# EAGLE design PCBWayPrototype (EAGLE 9.6.2)
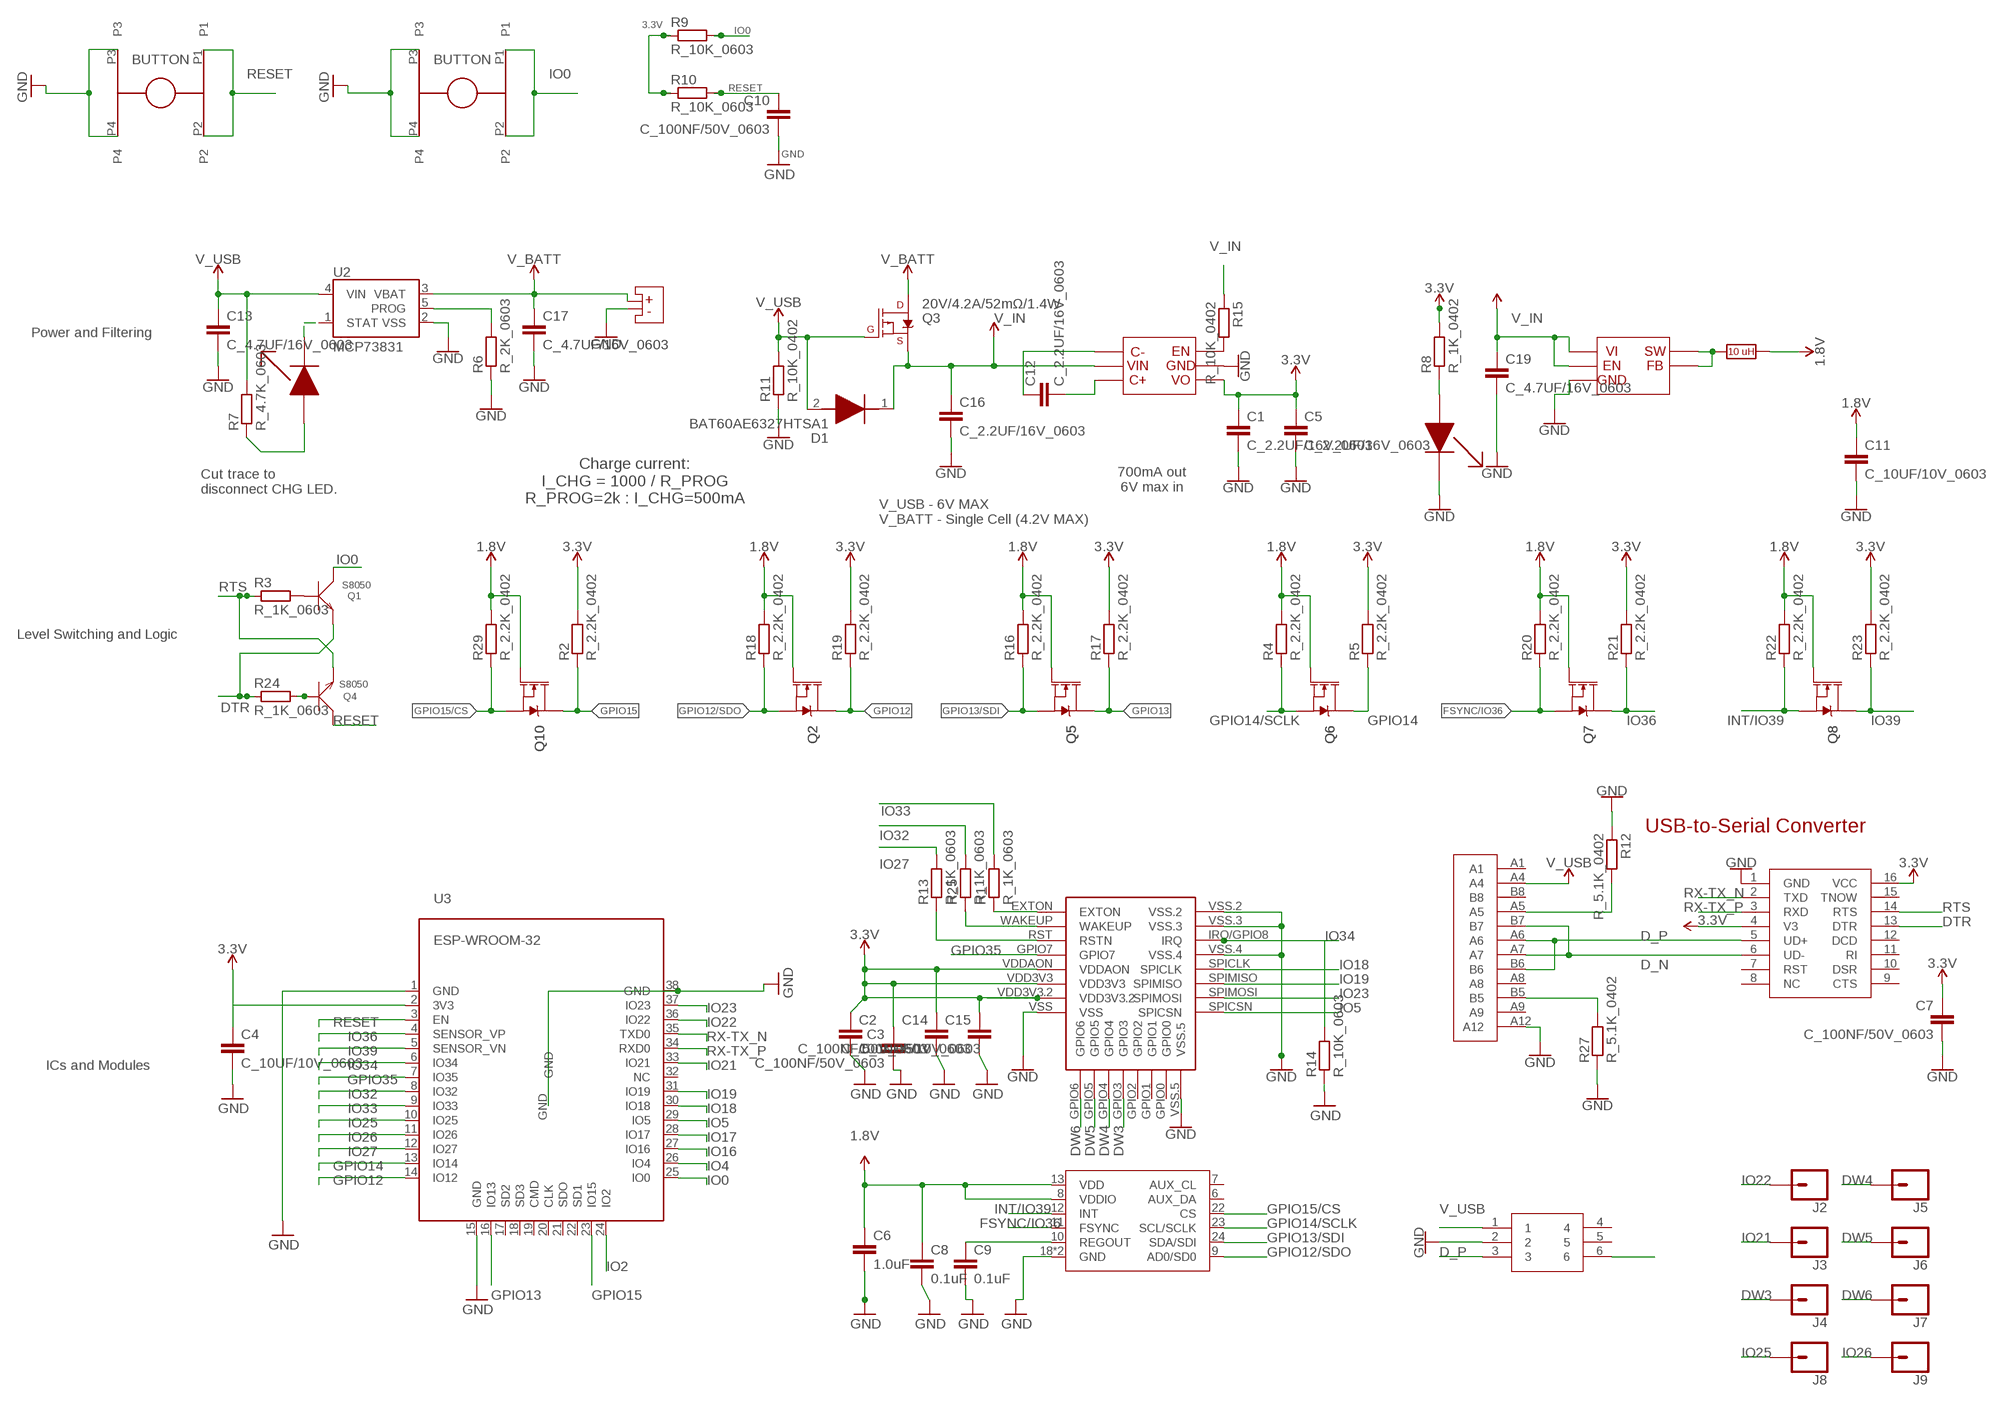
[diagram p0: schematic, sheet 1]

## Parts
C1  C_2.2UF/16V_0603  [C0603]
C2  C_10UF/10V_0603  [C0603]
C3  C_100NF/50V_0603  [C0603]
C4  C_10UF/10V_0603  [C0603]
C5  C_2.2UF/16V_0603  [C0603]
C6  1.0uF  1.0UF-0603-16V-10%-X7R  [0603]
C7  C_100NF/50V_0603  [C0603]
C8  0.1uF  0.1UF-0603-25V-5%  [0603]
C9  0.1uF  0.1UF-0603-25V-5%  [0603]
C10  C_100NF/50V_0603  [C0603]
C11  C_10UF/10V_0603  [C0603]
C12  C_2.2UF/16V_0603  [C0603]
C13  C_4.7UF/16V_0603  [C0603]
C14  C_100NF/50V_0603  [C0603]
C15  C_100NF/50V_0603  [C0603]
C16  C_2.2UF/16V_0603  [C0603]
C17  C_4.7UF/16V_0603  [C0603]
C19  C_4.7UF/16V_0603  [C0603]
D1  BAT60AE6327HTSA1  [SOD2513X110N]
J2  CONN_01PTH_2MM  [1X01_2MM]
J3  CONN_01PTH_2MM  [1X01_2MM]
J4  CONN_01PTH_2MM  [1X01_2MM]
J5  CONN_01PTH_2MM  [1X01_2MM]
J6  CONN_01PTH_2MM  [1X01_2MM]
J7  CONN_01PTH_2MM  [1X01_2MM]
J8  CONN_01PTH_2MM  [1X01_2MM]
J9  CONN_01PTH_2MM  [1X01_2MM]
Q1  S8050  TRANSISTOR-NPN-SOT23  [SOT23]
Q2  20V/0.2A/8MHz/1.2Ω/1Vth  MOSFET-NCH-RE1C002UN  [SOT-416FL]
Q3  20V/4.2A/52mΩ/1.4W  MOSFET_PCH-DMG2305UX-7  [SOT23-3@1]
Q4  S8050  TRANSISTOR-NPN-SOT23  [SOT23]
Q5  20V/0.2A/8MHz/1.2Ω/1Vth  MOSFET-NCH-RE1C002UN  [SOT-416FL]
Q6  20V/0.2A/8MHz/1.2Ω/1Vth  MOSFET-NCH-RE1C002UN  [SOT-416FL]
Q7  20V/0.2A/8MHz/1.2Ω/1Vth  MOSFET-NCH-RE1C002UN  [SOT-416FL]
Q8  20V/0.2A/8MHz/1.2Ω/1Vth  MOSFET-NCH-RE1C002UN  [SOT-416FL]
Q10  20V/0.2A/8MHz/1.2Ω/1Vth  MOSFET-NCH-RE1C002UN  [SOT-416FL]
R1  R_1K_0603  [R0603]
R2  R_2.2K_0402  [R0402]
R3  R_1K_0603  [R0603]
R4  R_2.2K_0402  [R0402]
R5  R_2.2K_0402  [R0402]
R6  R_2K_0603  [R0603]
R7  R_4.7K_0603  [R0603]
R8  R_1K_0402  [R0402]
R9  R_10K_0603  [R0603]
R10  R_10K_0603  [R0603]
R11  R_10K_0402  [R0402]
R12  R_5.1K_0402  [R0402]
R13  R_1K_0603  [R0603]
R14  R_10K_0603  [R0603]
R15  R_10K_0402  [R0402]
R16  R_2.2K_0402  [R0402]
R17  R_2.2K_0402  [R0402]
R18  R_2.2K_0402  [R0402]
R19  R_2.2K_0402  [R0402]
R20  R_2.2K_0402  [R0402]
R21  R_2.2K_0402  [R0402]
R22  R_2.2K_0402  [R0402]
R23  R_2.2K_0402  [R0402]
R24  R_1K_0603  [R0603]
R25  R_1K_0603  [R0603]
R27  R_5.1K_0402  [R0402]
R29  R_2.2K_0402  [R0402]
U2  MCP73831  [SOT23-5]
U3  ESP-WROOM-32  [ESP-WROOM-32]
U5  DWM1000  [DWM1000]
U$1  K2-6639SP-C4SC-04_C83206  [K2-6639SP-C4SC-04]
U$2  MLF2012  [MLF2012]
U$3  K2-6639SP-C4SC-04_C83206  [K2-6639SP-C4SC-04]
U$4  TPS62202DBVR  [TPS62202DBVR]
U$5  HE9008M6R  [HE9008M6R]
U$6  19-217/GHC-YR1S2/3T  [19-217/GHC-YR1S2/3T]
U$7  TPSMF05CT1G  [TPSMF05CT1G]
U$8  SM02B_PASS_TB_LF  [SM02B_PASS_TB_LF]
U$9  19-217/GHC-YR1S2/3T  [19-217/GHC-YR1S2/3T]
U$10  USBC19  [USBC19]
U$11  CH340B  [SOP-16]
U$12  ICM20948  [ICM20948]

## Nets
1.8V: C6.1 C8.1 C11.1 Q2.1(G) Q5.1(G) Q6.1(G) Q7.1(G) Q8.1(G) Q10.1(G) R4.2 R16.2 R18.2 R20.2 R22.2 R29.2 U$2.2 U$12.8(VDDIO) U$12.13(VDD)
3.3V: C1.1 C2.1 C3.1 C4.1 C5.1 C7.1 C14.1 C15.1 R2.2 R5.2 R8.2 R9.1 R10.1 R17.2 R19.2 R21.2 R23.2 U3.2(3V3) U5.VDD3V3 U5.VDD3V3.2 U5.VDDAON U$5.VOUT(VO) U$11.4(V3) U$11.16(VCC)
CHG_LED: R7.1 U$6.2
D_N [diff-pair-D]: U$7.6 U$10.A7 U$10.B7 U$11.6(UD-)
D_P [diff-pair-D]: U$7.3 U$10.A6 U$10.B6 U$11.5(UD+)
DTR: Q1.2(E) R24.1 U$11.13(DTR)
DW3: J4.1 U5.GPIO3
DW4: J5.1 U5.GPIO4
DW5: J6.1 U5.GPIO5
DW6: J7.1 U5.GPIO6
FSYNC/IO36: Q7.2(S) R20.1 U$12.11(FSYNC)
GND: C1.2 C2.2 C3.2 C4.2 C5.2 C6.2 C7.2 C8.2 C9.2 C10.2 C11.2 C13.2 C14.2 C15.2 C16.2 C17.2 C19.2 R6.1 R11.1 R12.1 R14.1 R27.1 U2.2(VSS) U3.1(GND) U3.15(GND) U3.38(GND) U3.GND U5.VSS U5.VSS.2 U5.VSS.3 U5.VSS.4 U5.VSS.5 U$1.P3 U$1.P4 U$3.P3 U$3.P4 U$4.2(GND) U$5.GND U$7.2 U$8.3(-) U$9.1 U$10.A12 U$11.1(GND) U$12.18(GND) U$12.20(GND)
GPIO12: Q2.3(D) R19.1 U3.14(IO12)
GPIO12/SDO: Q2.2(S) R18.1 U$12.9(AD0/SD0)
GPIO13: Q5.3(D) R17.1 U3.16(IO13)
GPIO13/SDI: Q5.2(S) R16.1 U$12.24(SDA/SDI)
GPIO14: Q6.3(D) R5.1 U3.13(IO14)
GPIO14/SCLK: Q6.2(S) R4.1 U$12.23(SCL/SCLK)
GPIO15: Q10.3(D) R2.1 U3.23(IO15)
GPIO15/CS: Q10.2(S) R29.1 U$12.22(CS)
GPIO35: U3.7(IO35) U5.GPIO7
INT/IO39: Q8.2(S) R22.1 U$12.12(INT)
IO0: Q1.3(C) R9.2 U3.25(IO0) U$3.P1 U$3.P2
IO2: U3.24(IO2)
IO4: U3.26(IO4)
IO5: U3.29(IO5) U5.SPICSN
IO16: U3.27(IO16)
IO17: U3.28(IO17)
IO18: U3.30(IO18) U5.SPICLK
IO19: U3.31(IO19) U5.SPIMISO
IO21: J3.1 U3.33(IO21)
IO22: J2.1 U3.36(IO22)
IO23: U3.37(IO23) U5.SPIMOSI
IO25: J8.1 U3.10(IO25)
IO26: J9.1 U3.11(IO26)
IO27: R13.2 U3.12(IO27)
IO32: R25.2 U3.8(IO32)
IO33: R1.2 U3.9(IO33)
IO34: R14.2 U3.6(IO34) U5.IRQ/GPIO8(IRQ)
IO36: Q7.3(D) R21.1 U3.4(SENSOR_VP)
IO39: Q8.3(D) R23.1 U3.5(SENSOR_VN)
N$1: Q4.1(B) R24.2
N$2: Q1.1(B) R3.2
N$3: R6.2 U2.5(PROG)
N$4: R8.1 U$9.2
N$7: U2.1(STAT) U$6.1
N$8: U$2.1 U$4.4(FB) U$4.5(SW)
N$9: R15.2 U$5.EN
N$10: R1.1 U5.EXTON
N$11: R25.1 U5.WAKEUP
N$12: R13.1 U5.RST(RSTN)
N$13: C9.1 U$12.10(REGOUT)
N$14: C12.1 U$5.C-
N$15: C12.2 U$5.C+
N$16: R27.2 U$10.B5
N$17: R12.2 U$10.A5
RESET: C10.1 Q4.3(C) R10.2 U3.3(EN) U$1.P1 U$1.P2
RTS: Q4.2(E) R3.1 U$11.14(RTS)
RX-TX_N [diff-pair-RT]: U3.35(TXD0) U$11.2(TXD)
RX-TX_P [diff-pair-RT]: U3.34(RXD0) U$11.3(RXD)
V_BATT: C17.1 Q3.3(D) U2.3(VBAT) U$8.4(+)
V_IN: C16.1 C19.1 D1.1(K) Q3.2(S) R15.1 U$4.1(VI) U$4.3(EN) U$5.VIN ; supply symbol labelled VIN
V_USB: C13.1 D1.2(A) Q3.1(G) R7.2 R11.2 U2.4(VIN) U$7.1 U$10.A4
Unconnected: U3.17(SD2) U3.18(SD3) U3.19(CMD) U3.20(CLK) U3.21(SDO) U3.22(SD1) U3.32(NC) U5.GPIO0 U5.GPIO1 U5.GPIO2 U$7.4 U$7.5 U$10.A1 U$10.A8 U$10.A9 U$10.B8 U$11.7(RST) U$11.8(NC) U$11.9(CTS) U$11.10(DSR) U$11.11(RI) U$11.12(DCD) U$11.15(TNOW) U$12.6(AUX_DA) U$12.7(AUX_CL)

## Notes on the sheet
- Power and Filtering
- 700mA out
  6V max in
- Charge current:
  I_CHG = 1000 / R_PROG
  R_PROG=2k : I_CHG=500mA
- Cut trace to 
  disconnect CHG LED.
- V_USB - 6V MAX
  V_BATT - Single Cell (4.2V MAX)
- Level Switching and Logic
- USB-to-Serial Converter
- ICs and Modules

## Library data of the parts
C1 C5 C12 C16 = JLC PCB Basic Parts_loc:C_: Capacitor General purpose SMD Capacitor; LCSC_DATASHEET: https://datasheet.lcsc.com/lcsc/1810271109_Samsung-Electro-Mechanics-CL10A225KO8NNNC_C23630.pdf; LCSC_PART: C23630; LCSC_ROTATION_CCW: 0; LCSC_STOCK: 1324345; PROPERTIES: 16V 2.2uF X5R ±10% 0603 ROHS
C2 C4 C11 = JLC PCB Basic Parts_loc:C_: Capacitor General purpose SMD Capacitor; LCSC_DATASHEET: https://datasheet.lcsc.com/lcsc/1810191219_Samsung-Electro-Mechanics-CL10A106KP8NNNC_C19702.pdf; LCSC_PART: C19702; LCSC_ROTATION_CCW: 0; LCSC_STOCK: 2089400; PROPERTIES: 10V 10uF X5R ±10% 0603 ROHS
C3 C7 C10 C14 C15 = JLC PCB Basic Parts_loc:C_: Capacitor General purpose SMD Capacitor; LCSC_DATASHEET: https://datasheet.lcsc.com/lcsc/1809301912_YAGEO-CC0603KRX7R9BB104_C14663.pdf; LCSC_PART: C14663; LCSC_ROTATION_CCW: 0; LCSC_STOCK: 7111530; PROPERTIES: 50V 100nF X7R ±10% 0603 ROHS
C6 = SparkFun-Capacitors:1.0UF: 1µF ceramic capacitors A capacitor is a passive two-terminal electrical component used to store electrical energy temporarily in an electric field.; PROD_ID: CAP-13930
C8 C9 = SparkFun-Capacitors:0.1UF: 0.1µF ceramic capacitors A capacitor is a passive two-terminal electrical component used to store electrical energy temporarily in an electric field.; PROD_ID: CAP-08604
C13 C17 C19 = JLC PCB Basic Parts_loc:C_: Capacitor General purpose SMD Capacitor; LCSC_DATASHEET: https://datasheet.lcsc.com/lcsc/1810261514_Samsung-Electro-Mechanics-CL10A475KO8NNNC_C19666.pdf; LCSC_PART: C19666; LCSC_ROTATION_CCW: 0; LCSC_STOCK: 2027167; PROPERTIES: 16V 4.7uF X5R ±10% 0603 ROHS
D1 = BAT60AE6327HTSA1:BAT60AE6327HTSA1: INFINEON - BAT60AE6327HTSA1 - RECTIFIER, SCHOTTKY, 3A, 10V, SOD-323 Source: Datasheet <https://www.infineon.com/dgdl/Infineon-BAT60ASERIES-DS-v01_01-en.pdf?fileId=db3a304313d846880113def70c9304a9>; DESCRIPTION: INFINEON - BAT60AE6327HTSA1 - RECTIFIER, SCHOTTKY, 3A, 10V, SOD-323; HEIGHT: 1.1mm; MANUFACTURER_NAME: Infineon; MANUFACTURER_PART_NUMBER: BAT60AE6327HTSA1; MOUSER_PART_NUMBER: 726-BAT60AE6327HTSA1; MOUSER_PRICE-STOCK: https://www.mouser.co.uk/ProductDetail/Infineon-Technologies/BAT60AE6327HTSA1?qs=OwbwYO03UsIW3Y2lCXbs8Q%3D%3D
J2-J9 = SparkFun-Connectors:CONN_01: Single connection point. Often used as Generic Header-pin footprint for 0.1 inch spaced/style header connections On any of the 0.1 inch spaced packages, you can populate with these: Break Away Headers - Straight <https://www.sparkfun.com/products/116> (PRT-00116) Break Away Male Headers - Right Angle <https://www.sparkfun.com/products/553> (PRT-00553) Female Headers <https://www.sparkfun.com/products/115> (PRT-00115) Break Away Headers - Machine Pin <https://www.sparkfun.com/products/117> (PRT-00117) Break Away Female Headers - Swiss Machine Pin <https://www.sparkfun.com/products/743> (PRT-00743) This device is also useful as a general connection point to wire up your design to another part of your project. Our various solder wires solder well into these plated through hole pads. Hook-Up Wire - Assortment (Stranded, 22 AWG) <https://www.sparkfun.com/products/11375> (PRT-11375) Hook-Up Wire - Assortment (Solid Core, 22 AWG) <https://www.sparkfun.com/products/11367> (PRT-11367) View the entire wire category on our website here <https://www.sparkfun.com/categories/141> Special notes: SMTSO-256-ET is a "flush mount" nut for a 4-40 screw. We mostly use this on specialty testbeds; it is a nice way to connect hardware to your PCB at an adjustable hieght. Also note, the SNAP packages are for using a snappable style connector. We sell a baggie of snaps and they are also used on two LilyPad designs: Snap Assortment - 30 pack (male and female) <https://www.sparkfun.com/products/11347> (DEV-11347) LilyPad Arduino SimpleSnap <https://www.sparkfun.com/products/10941> (DEV-10941) LilyPad SimpleSnap Protoboard <https://www.sparkfun.com/products/10940> (DEV-10940)
Q1 Q4 = Discrete:TRANSISTOR-NPN*: NPN audion
Q2 Q5-Q8 Q10 = SparkFun-DiscreteSemi:MOSFET-NCH: N-channel MOSFETs Voltage controlled devices that allow control of high current outputs. SparkFun Products: SparkFun OpenScale <https://www.sparkfun.com/products/13261> SparkFun Digital Sandbox <https://www.sparkfun.com/products/12651> SparkFun Monster Moto Shield <https://www.sparkfun.com/products/10182> SparkFun MOSFET Power Controller <https://www.sparkfun.com/products/11214>; PROD_ID: TRANS_14399
Q3 = SparkFun-DiscreteSemi:MOSFET_PCH: P-channel MOSFETs Voltage controlled devices that allow control of high current outputs. SparkFun Products: SparkFun ESP32 Thing <https://www.sparkfun.com/products/13907> SparkFun ESP8266 Thing <https://www.sparkfun.com/products/13231> SparkFun Pi Servo HAT V2 <https://www.sparkfun.com/products/15316> DMG2305UX-7 (20V/4.2A/SOT23-3); PROD_ID: TRANS-14388
R1 R3 R13 R24 R25 = JLC PCB Basic Parts_loc:R_: Resistor General purpose SMD Resistor; LCSC_DATASHEET: https://datasheet.lcsc.com/lcsc/2110252030_UNI-ROYAL-Uniroyal-Elec-0603WAF1001T5E_C21190.pdf; LCSC_PART: C21190; LCSC_ROTATION_CCW: 0; LCSC_STOCK: 5175299; PROPERTIES: ±1% 1/10W Thick Film Resistors 75V ±100ppm -55°C~+155°C 1kOhm 0603 ROHS
R2 R4 R5 R16-R23 R29 = JLC PCB Basic Parts_loc:R_: Resistor General purpose SMD Resistor; LCSC_DATASHEET: https://datasheet.lcsc.com/lcsc/2110260030_UNI-ROYAL-Uniroyal-Elec-0402WGF2201TCE_C25879.pdf; LCSC_PART: C25879; LCSC_ROTATION_CCW: 0; LCSC_STOCK: 387501; PROPERTIES: ±1% 1/16W Thick Film Resistors 50V ±100ppm -55°C~+155°C 2.2kOhm 0402 ROHS
R6 = JLC PCB Basic Parts_loc:R_: Resistor General purpose SMD Resistor; LCSC_DATASHEET: https://datasheet.lcsc.com/lcsc/2110252130_UNI-ROYAL-Uniroyal-Elec-0603WAF2001T5E_C22975.pdf; LCSC_PART: C22975; LCSC_ROTATION_CCW: 0; LCSC_STOCK: 3372290; PROPERTIES: ±1% 1/10W Thick Film Resistors 75V ±100ppm -55°C~+155°C 2kOhm 0603 ROHS
R7 = JLC PCB Basic Parts_loc:R_: Resistor General purpose SMD Resistor; LCSC_DATASHEET: https://datasheet.lcsc.com/lcsc/2110252130_UNI-ROYAL-Uniroyal-Elec-0603WAF4701T5E_C23162.pdf; LCSC_PART: C23162; LCSC_ROTATION_CCW: 0; LCSC_STOCK: 3103173; PROPERTIES: ±1% 1/10W Thick Film Resistors 75V ±100ppm -55°C~+155°C 4.7kOhm 0603 ROHS
R8 = JLC PCB Basic Parts_loc:R_: Resistor General purpose SMD Resistor; LCSC_DATASHEET: https://datasheet.lcsc.com/lcsc/2110251730_UNI-ROYAL-Uniroyal-Elec-0402WGF1001TCE_C11702.pdf; LCSC_PART: C11702; LCSC_ROTATION_CCW: 0; LCSC_STOCK: 3758383; PROPERTIES: ±1% 1/16W Thick Film Resistors 50V ±100ppm -55°C~+155°C 1kOhm 0402 ROHS
R9 R10 R14 = JLC PCB Basic Parts_loc:R_: Resistor General purpose SMD Resistor; LCSC_DATASHEET: https://datasheet.lcsc.com/lcsc/2110260030_UNI-ROYAL-Uniroyal-Elec-0603WAF1002T5E_C25804.pdf; LCSC_PART: C25804; LCSC_ROTATION_CCW: 0; LCSC_STOCK: 7979018; PROPERTIES: ±1% 1/10W Thick Film Resistors 75V ±100ppm -55°C~+155°C 10kOhm 0603 ROHS
R11 R15 = JLC PCB Basic Parts_loc:R_: Resistor General purpose SMD Resistor; LCSC_DATASHEET: https://datasheet.lcsc.com/lcsc/2110260030_UNI-ROYAL-Uniroyal-Elec-0402WGF1002TCE_C25744.pdf; LCSC_PART: C25744; LCSC_ROTATION_CCW: 0; LCSC_STOCK: 11564817; PROPERTIES: ±1% 1/16W Thick Film Resistors 50V ±100ppm -55°C~+155°C 10kOhm 0402 ROHS
R12 R27 = JLC PCB Basic Parts_loc:R_: Resistor General purpose SMD Resistor; LCSC_DATASHEET: https://datasheet.lcsc.com/lcsc/2110260030_UNI-ROYAL-Uniroyal-Elec-0402WGF5101TCE_C25905.pdf; LCSC_PART: C25905; LCSC_ROTATION_CCW: 0; LCSC_STOCK: 1228443; PROPERTIES: ±1% 1/16W Thick Film Resistors 50V ±100ppm -55°C~+155°C 5.1kOhm 0402 ROHS
U2 = SparkFun-IC-Power:MCP73831: MCP73831T Li-Ion, Li-Pol Controller Miniature single cell, fully integrated Li-Ion, Li-polymer charge management controller Datasheet <http://ww1.microchip.com/downloads/en/DeviceDoc/20001984g.pdf> SparkFun Products: SparkFun ESP32 Thing <https://www.sparkfun.com/products/13907> SparkFun 9DoF Razor IMU M0 <https://www.sparkfun.com/products/14001>; PROD_ID: IC-09995
U3 = ESP32:ESP-WROOM-32
U5 = DWM1000:DWM1000
U$1 U$3 = customlib:K2-6639SP-C4SC-04_C83206: K2-6639SP-C4SC-04_C83206 button, https://datasheet.lcsc.com/lcsc/2108131530_Korean-Hroparts-Elec-K2-6639SP-C4SC-04_C83206.pdf
U$2 = customlib:MLF2012: MLF2012 0805 10uH Inductor
U$4 = customlib:TPS62202DBVR
U$5 = customlib:HE9008M6R
U$6 U$9 = customlib:19-217/GHC-YR1S2/3T
U$7 = customlib:TPSMF05CT1G
U$8 = customlib:SM02B_PASS_TB_LF
U$10 = customlib:USBC19
U$11 = customlib:CH340B
U$12 = customlib:ICM20948

## Net classes
0 default: width 0.127 mm, drill 0.305 mm
1 power: width 0.305 mm, drill 0.305 mm

## Board
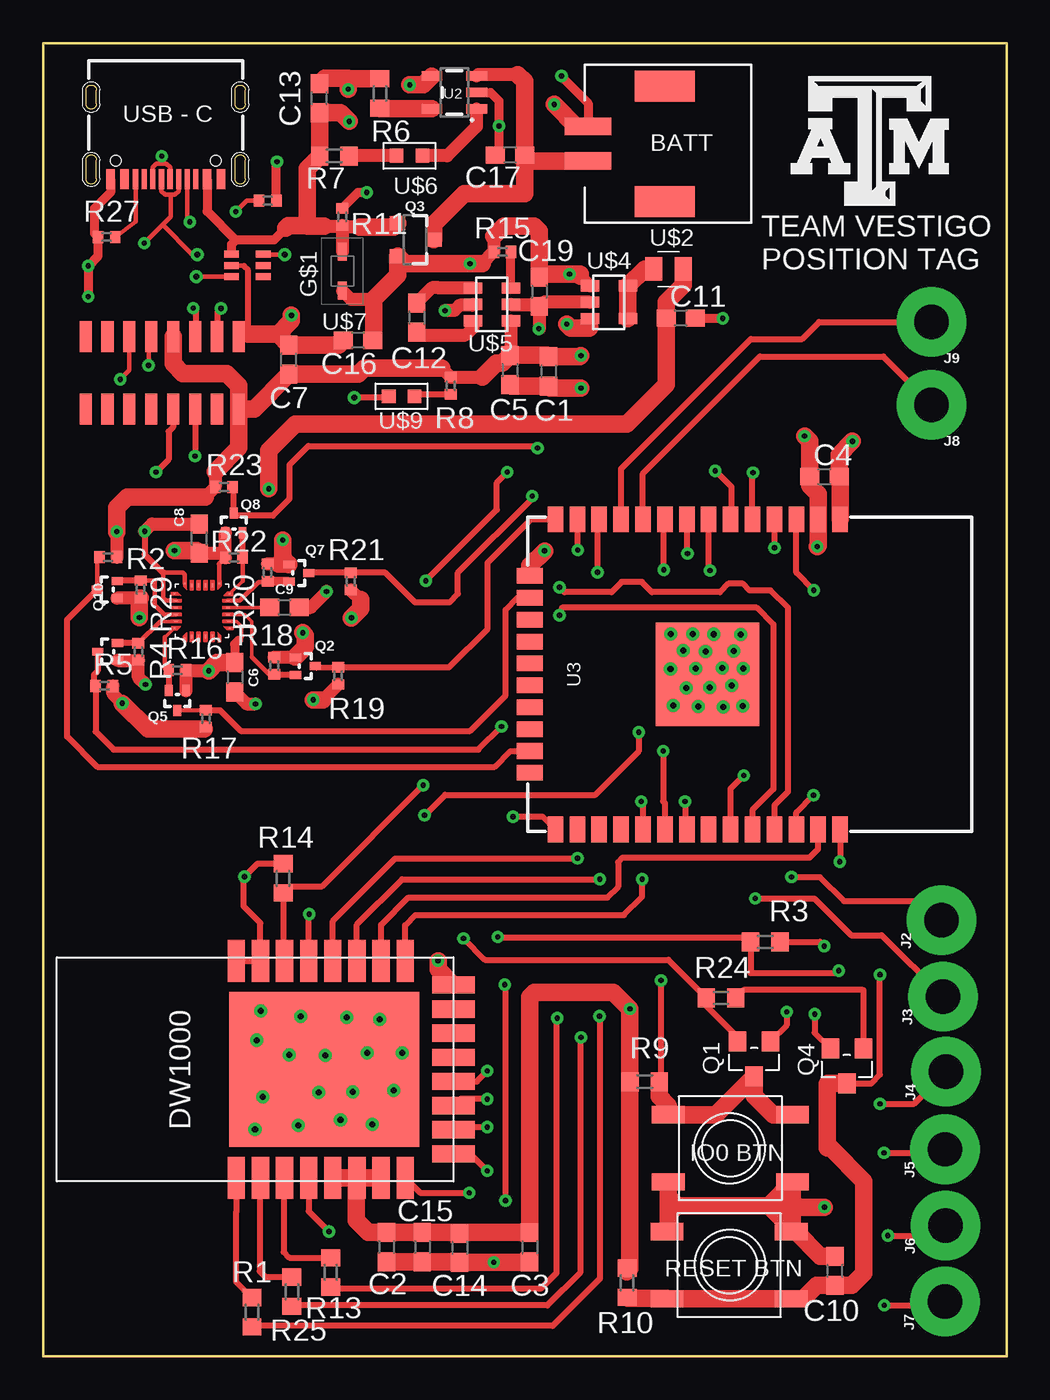
[diagram p1: board, top side]
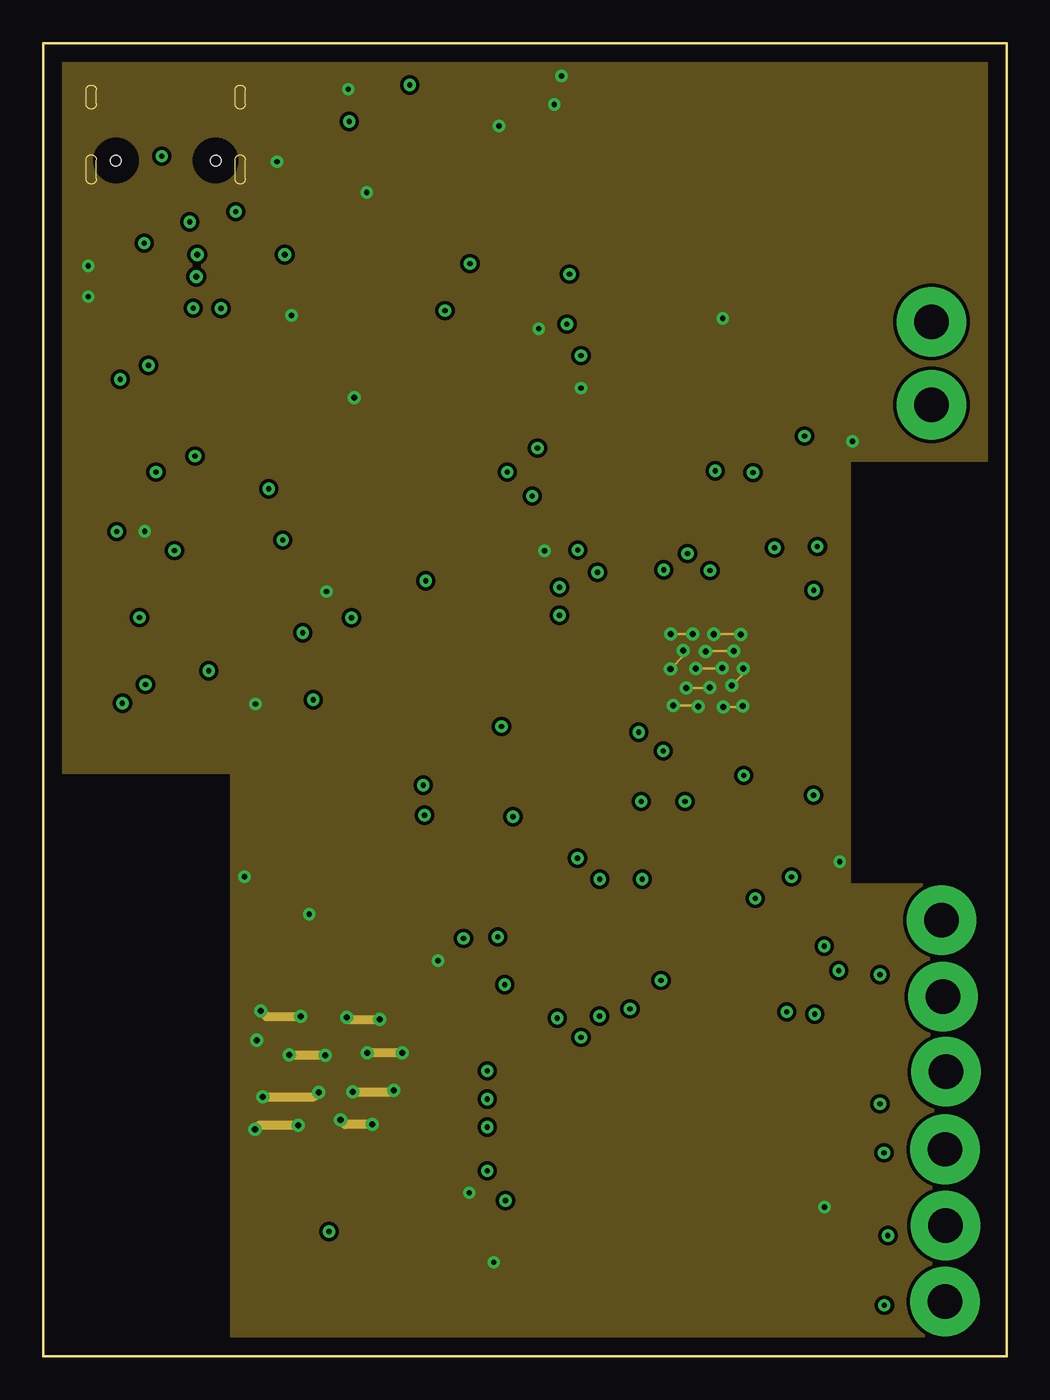
[diagram p2: board, inner layer GND1]
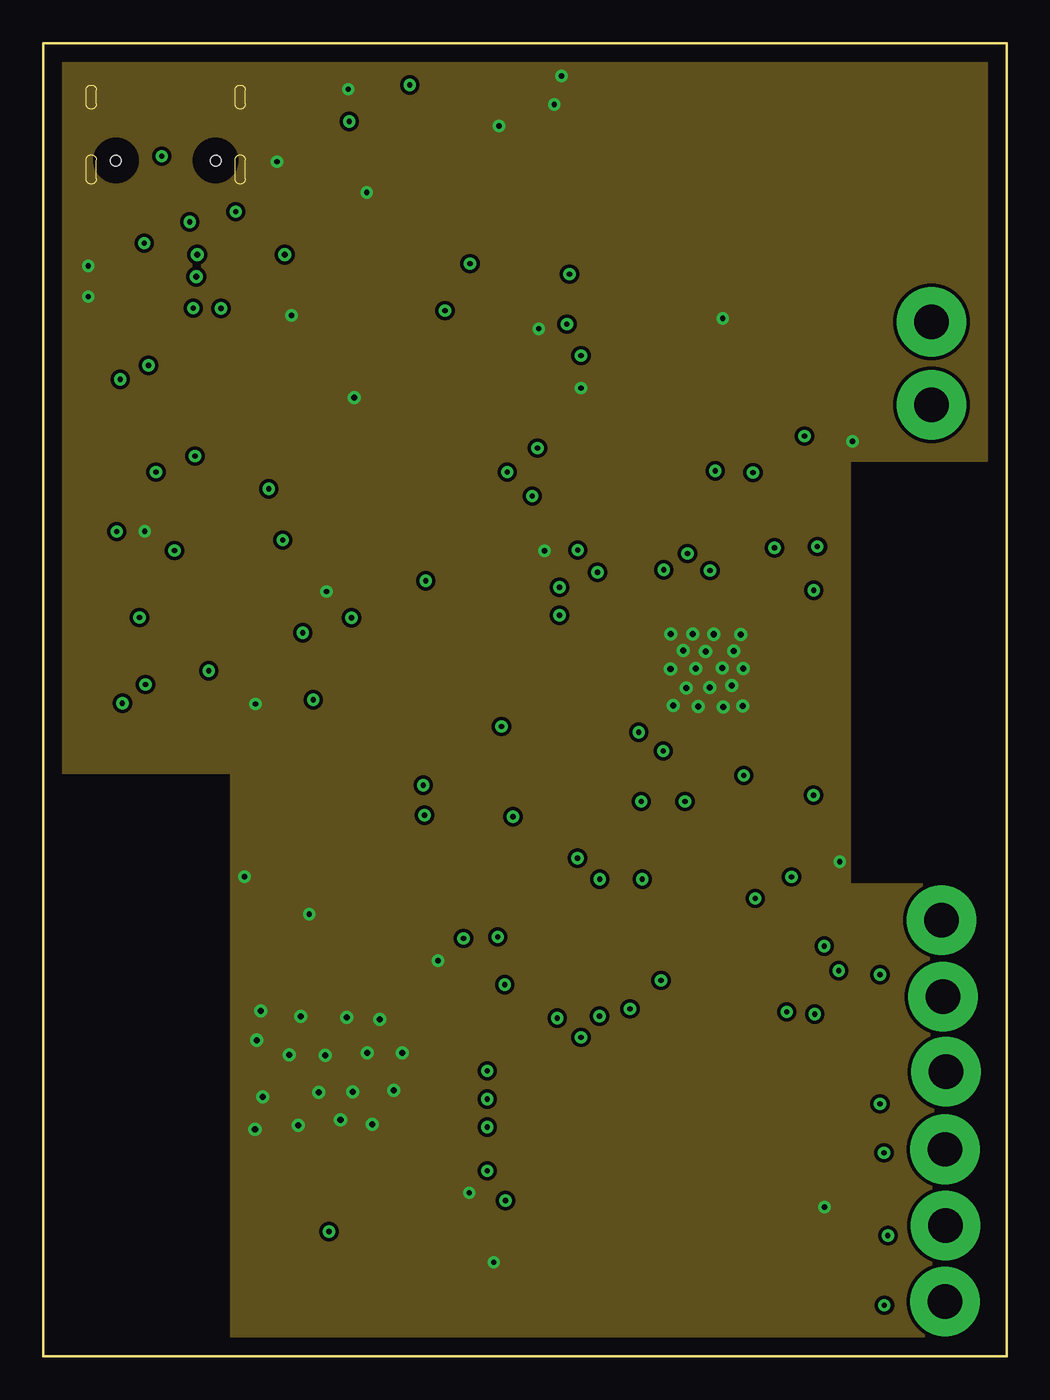
[diagram p3: board, inner layer GND2]
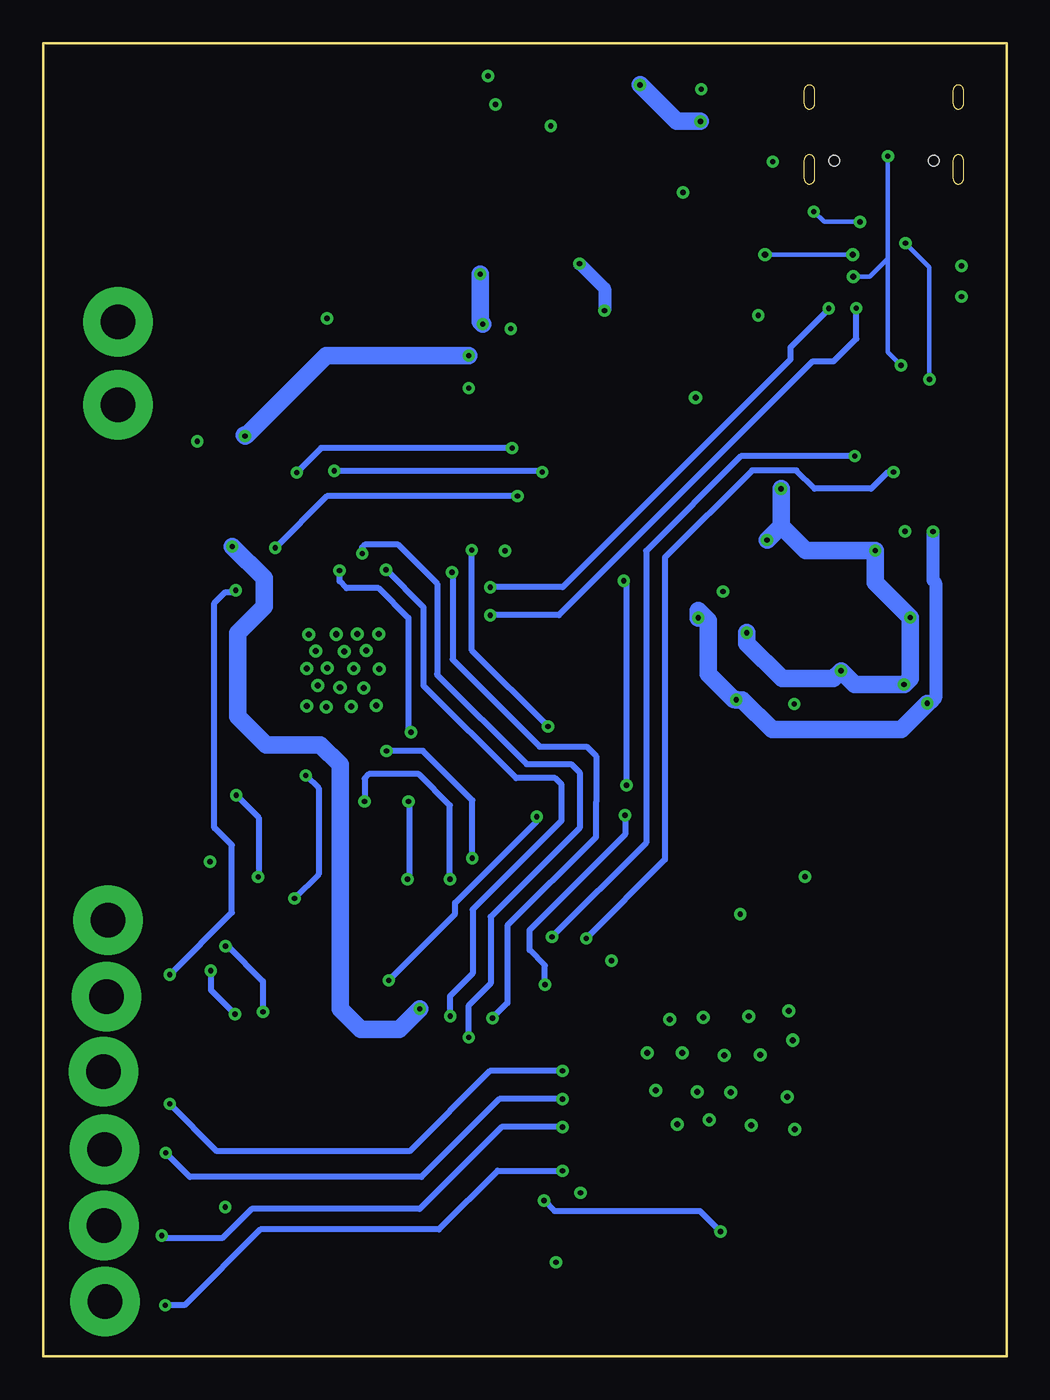
[diagram p4: board, bottom side, seen from below]

Size 55.88 x 76.2 mm. Coordinates in mm from the lower left corner, seen from the top.
Outline: 55.88,0 55.88,76.2 0,76.2 0,0 55.88,0
Copper layers (1+2*15+16): Top 0.035mm / dielectric 0.11mm / GND1 0.0348mm / dielectric 1.2mm / GND2 0.0348mm / dielectric 0.11mm / Bottom 0.035mm
Design rules "default *": minimum track width 8mil, minimum drill 12mil, track to track 6mil, track to pad 6mil, pad to pad 6mil, via to via 20mil, smd to smd 6mil, copper to edge 40mil, drill to drill 0.3mm, minimum pad ring 40mil, minimum via ring 8mil, stop-mask expansion 4mil, vias tented up to drill 0mil, thermal gap 10mil
tKeepout: area 47.2,27.6 to 54.7,51.6; area 0.6,0.5 to 10.6,33.5

### Footprints (pad centres in the part's own frame; a part is rotated, then mirrored left to right if it is on the bottom)
C0603 = smd 1.1 x 1: 1 -0.85,0; 2 0.85,0
0603 = smd 1.1 x 1: 1 -0.85,0; 2 0.85,0
SOD2513X110N = smd 1.05 x 0.5: 1 -1.138,0; 2 1.138,0
1X01_2MM = drill 2 pad 3.302: 1 0,0
SOT23 = smd 1.016 x 1.143: 1 -0.95,-1.016; 2 0.95,-1.016; 3 0,1.016
SOT-416FL = smd 0.46 x 0.65: 1 -0.5,-1.1; 2 0.5,-1.1; 3 0,0.05
SOT23-3@1 = smd 0.8 x 0.9: 1 -0.95,-1; 2 0.95,-1; 3 0,1.1
R0603 = smd 1 x 1.1: 1 -0.85,0; 2 0.85,0
R0402 = smd 0.6 x 0.7: 1 -0.5,0; 2 0.5,0
SOT23-5 = smd 0.55 x 1.2: 1 -0.95,-1.3; 2 0,-1.3; 3 0.95,-1.3; 4 0.95,1.3; 5 -0.95,1.3
ESP-WROOM-32 = smd 0.9 x 1.5: 1 7.7,9; 2 6.43,9; 3 5.16,9; 4 3.89,9; 5 2.62,9; 6 1.35,9; 7 0.08,9; 8 -1.19,9; 9 -2.46,9; 10 -3.73,9; 11 -5,9; 12 -6.27,9; 13 -7.54,9; 14 -8.81,9; 25 -8.81,-9; 26 -7.54,-9; 27 -6.27,-9; 28 -5,-9; 29 -3.73,-9; 30 -2.46,-9; 31 -1.19,-9; 32 0.08,-9; 33 1.35,-9; 34 2.62,-9; 35 3.89,-9; 36 5.16,-9; 37 6.43,-9; 38 7.7,-9 | smd 1.5 x 0.9: 15 -10.3,5.715; 16 -10.3,4.445; 17 -10.3,3.175; 18 -10.3,1.905; 19 -10.3,0.635; 20 -10.3,-0.635; 21 -10.3,-1.905; 22 -10.3,-3.175; 23 -10.3,-4.445; 24 -10.3,-5.715 | smd 6 x 6: GND 0,0
DWM1000 = smd 2.45 x 1: EXTON -2.8,12.6; GPIO7 -2.8,8.4; IRQ/GPIO8 9.8,9.8; RST -2.8,9.8; SPICLK 9.8,7; SPICSN 9.8,2.8; SPIMISO 9.8,5.6; SPIMOSI 9.8,4.2; VDD3V3 -2.8,4.2; VDD3V3.2 -2.8,5.6; VDDAON -2.8,7; VSS -2.8,2.8; VSS.2 9.8,12.6; VSS.3 9.8,11.2; VSS.4 9.8,8.4; WAKEUP -2.8,11.2 | smd 9 x 11: GND 3.5,7.5 | smd 1 x 2.45: GPIO0 7,0; GPIO1 5.6,0; GPIO2 4.2,0; GPIO3 2.8,0; GPIO4 1.4,0; GPIO5 0,0; GPIO6 -1.4,0; VSS.5 8.4,0
K2-6639SP-C4SC-04 = smd 1 x 1.9: P1 1.95,3.6; P2 1.95,-3.6; P3 -1.95,3.6; P4 -1.95,-3.6
MLF2012 = smd 1 x 1.35: 1 0.85,0; 2 -0.85,0
TPS62202DBVR = smd 1.06 x 0.65: 1 1.1,-0.95; 2 1.1,0; 3 1.1,0.95; 4 -1.1,0.95; 5 -1.1,-0.95
HE9008M6R = smd 0.65 x 1.06: C+ -0.95,1.1; C- 0.95,1.1; EN 0.95,-1.1; GND 0,-1.1; VIN 0,1.1; VOUT -0.95,-1.1
19-217/GHC-YR1S2/3T = smd 0.8 x 0.8: 1 -0.75,0; 2 0.75,0
TPSMF05CT1G = smd 0.4 x 0.85: 1 -0.65,-0.925; 2 0,-0.925; 3 0.65,-0.925; 4 0.65,0.925; 5 0,0.925; 6 -0.65,0.925
SM02B_PASS_TB_LF = smd 1.8 x 3.5: 1 -3.35,2.098; 2 3.35,2.098 | smd 1 x 2.7: 3 -1,-2.352; 4 1,-2.352
USBC19 = smd 0.5 x 1.14: A1 -3.2,0.05; A4 -2.4,0.05; A12 3.2,0.05 | smd 0.3 x 1.14: A5 -1.25,0.05; A6 -0.25,0.05; A7 0.25,0.05; A8 1.25,0.05; B5 1.75,0.05; B6 0.75,0.05; B7 -0.75,0.05; B8 -1.75,0.05 | smd 0.5 x 1.15: A9 2.4,0.05 | hole 0.6: 2.89,-1.037; -2.89,-1.037
SOP-16 = smd 0.7 x 1.8: 1 4.445,2.1; 2 3.175,2.1; 3 1.905,2.1; 4 0.635,2.1; 5 -0.635,2.1; 6 -1.905,2.1; 7 -3.175,2.1; 8 -4.445,2.1; 9 -4.445,-2.1; 10 -3.175,-2.1; 11 -1.905,-2.1; 12 -0.635,-2.1; 13 0.635,-2.1; 14 1.905,-2.1; 15 3.175,-2.1; 16 4.445,-2.1
ICM20948 = smd 0.1 x 0.1: 1 -1.6,1; 6 -1.6,-1; 7 -1,-1.6; 12 1,-1.6; 13 1.6,-1; 18 1.6,1; 19 1,1.6; 24 -1,1.6 | smd 0.2 x 0.1: 2 -1.5,0.6; 3 -1.5,0.2; 4 -1.5,-0.2; 5 -1.5,-0.6; 14 1.5,-0.6; 15 1.5,-0.2; 16 1.5,0.2; 17 1.5,0.6 | smd 0.1 x 0.2: 8 -0.6,-1.55; 9 -0.2,-1.5; 10 0.2,-1.5; 11 0.6,-1.5; 20 0.6,1.5; 21 0.2,1.5; 22 -0.2,1.5; 23 -0.6,1.5

### Placement (x,y rotation side)
C1  29.31,57.15 270 top
C2  19.91,6.34 270 top
C3  28.22,6.34 270 top
C4  45.31,51.04 0 top
C5  27.08,57.23 270 top
C6  11.12,39.4 270 top
C7  14.25,57.84 90 top
C8  9.06,47.45 90 top
C9  14,43.46 0 top
C10  45.94,4.96 90 top
C11  36.98,60.25 0 top
C12  21.67,60.27 270 top
C13  16.03,73 90 top
C14  24.16,6.3 270 top
C15  22,6.35 270 top
C16  18.26,58.95 180 top
C17  27.08,69.7 180 top
C19  28.78,61.77 270 top
D1  17.35,62.97 90 top
J2  52.12,25.3 90 top
J3  52.2,20.88 90 top
J4  52.37,16.51 90 top
J5  52.32,12.01 90 top
J6  52.35,7.59 90 top
J7  52.3,3.17 90 top
J8  51.54,55.22 180 top
J9  51.54,60.02 180 top
Q1  41.24,17.26 180 top
Q2  15.74,40.05 270 top
Q3  21.56,64.8 270 top
Q4  46.62,16.85 180 top
Q5  7.79,37.53 180 top
Q6  3.22,40.89 90 top
Q7  15.36,45.46 270 top
Q8  11.07,48.89 0 top
Q10  3.19,44.49 90 top
R1  12.12,2.57 270 top
R2  3.78,46.37 0 top
R3  41.88,24.05 0 top
R4  5.53,40.89 270 top
R5  3.55,38.9 0 top
R6  19.53,73.28 270 top
R7  16.89,69.65 180 top
R8  23.64,56.32 90 top
R9  34.89,15.94 0 top
R10  33.87,4.28 270 top
R11  17.35,66.12 270 top
R12  13.03,67.06 180 top
R13  16.69,4.88 270 top
R14  13.92,27.74 270 top
R15  26.64,64.08 0 top
R16  7.79,39.82 0 top
R17  9.44,37 270 top
R18  13.4,40.07 90 top
R19  17.11,39.49 270 top
R20  13.02,45.48 90 top
R21  17.85,44.98 270 top
R22  11.07,46.35 180 top
R23  10.48,50.44 180 top
R24  39.32,20.8 0 top
R25  14.43,3.76 270 top
R27  3.68,64.95 0 top
R29  5.66,44.52 270 top
U2  23.85,73.33 90 top
U3  38.52,39.57 0 top
U5  23.8,13.15 90 top
U$1  39.79,5.3 270 top
U$2  36.27,63.09 180 top
U$3  39.86,12.08 90 top
U$4  32.82,61.16 180 top
U$5  26.04,61.04 90 top
U$6  21.25,69.66 180 top
U$7  11.85,63.3 270 top
U$8  33.96,70.36 270 top
U$9  20.79,55.7 0 top
U$10  7.11,68.35 180 top
U$11  6.91,57.07 0 top
U$12  9.22,43.25 90 top

### Tracks (layer width: path | path; a pad name or v marks a point on that pad's centre or on a via)
1.8V  (via drill 0.3)
  Top 0.203: 11.52,41.74 11.52,42.36 11.23,42.65 U$12.8
  Top 0.254: R22.2 10.19,45.97 10.22,45.93 U$12.13 | 11.34,41.55 11.52,41.74
  Top 0.508: 11.34,41.55 11.12,41.33 C6.1
  Top 0.762: R18.2 14.62,40.57 Q2.1 | R29.2 5.63,43.99 Q10.1 | Q6.1 R4.2 5.53,39.4 v5.94,38.99 | Q5.1 R16.2 8.33,39.78 v9.6,39.78 | 13.66,45.98 R20.2 | C8.1 10.32,46.6 R22.2 Q8.1
  Top 1.016: U$2.2 37.12,62.17 36.13,61.18 C11.1 36.13,56.38 33.86,54.1 14.63,54.1 13.08,52.55 v13.08,50.34 | v5.59,42.88 5.59,43.95 5.63,43.99 | v15.06,41.99 15.21,41.83 15.21,41.17 14.62,40.57 | 13.66,45.98 14.23,45.98 Q7.1 13.89,46.32 v13.89,47.37 | v9.6,39.78 10.07,40.25 C6.1 | v7.62,46.76 8.9,46.76 C8.1
  Bottom 1.016: v13.08,50.34 13.08,48.18 | 13.08,48.18 v13.89,47.37 | 13.08,48.18 11.66,46.76 v7.62,46.76 7.62,44.91 v5.59,42.88 5.59,39.34 v5.94,38.99 8.81,38.99 v9.6,39.78 10.06,39.32 13.01,39.32 15.06,41.38 v15.06,41.99
3.3V  (via drill 0.3)
  Top 0.762: U$5.VOUT 27.14,58.13 C5.1 | 18.41,43.91 R21.2 | 9.97,51.35 R23.2 9.39,49.86 | v4.28,47.84 R2.2 | v4.6,37.9 4.05,38.45 R5.2 | R19.2 16.22,38.1 | 23.13,57.33 R8.2 25.46,56.82 | 9.34,36.4 R17.2
  Top 1.016: v44.91,46.99 44.95,47.04 U3.2 44.95,50.02 44.46,50.51 C4.1 44.46,53.1 v44.17,53.4 | v4.6,37.9 6.1,36.4 9.34,36.4 | v31.19,58.06 31.13,58 C1.1 29.2,58.11 27.11,58.11 C5.1 26.64,57.64 26.28,57.64 25.46,56.82 | R10.1 33.86,4.92 34.04,5.09 R9.1 v34.04,20.17 33.07,21.13 28.5,21.13 28.22,20.85 28.22,8.46 C3.1 24.19,7.19 C14.1 24.11,7.2 C15.1 21.99,7.19 C2.1 18.84,7.19 18.15,7.88 18.15,10.3 U5.VDD3V3.2 | v17.88,42.85 18.41,43.38 18.41,43.91 | v15.67,38.1 16.22,38.1 | 23.13,57.33 18.62,57.33 18.28,56.99 C7.1 12.23,54.97 U$11.16 | 9.39,49.86 4.87,49.86 4.26,49.25 4.26,47.86 v4.27,47.85 v4.28,47.84 | U5.VDDAON U5.VDD3V3.2 | U5.VDD3V3 U5.VDD3V3.2 | U$11.16 11.36,52.73 9.97,51.35 | U$11.16 11.36,56.31 10.64,57.03 8.11,57.03 7.54,57.59 U$11.4
  Bottom 0.762: v4.27,47.85 4.27,45.03 4.11,44.87 4.11,38.19 4.4,37.9 v4.6,37.9
  Bottom 1.016: v44.17,53.4 44.22,53.45 44.06,53.45 39.45,58.06 v31.19,58.06 | v4.6,37.9 6.12,36.37 13.6,36.37 15.32,38.1 v15.67,38.1 15.69,38.11 15.81,38.11 17.3,39.6 17.3,42.7 17.88,43.28 v17.88,42.85 | v34.04,20.17 35.23,18.97 37.47,18.97 38.66,20.17 38.66,34.34 39.8,35.48 42.95,35.48 44.6,37.13 44.6,41.96 43.07,43.5 43.07,45.15 v44.91,46.99
CHG_LED
  Top 0.762: U$6.2 17.75,69.66 R7.1
D_N  (via drill 0.3, 0.35)
  Top 0.254: U$10.A7 6.86,67.61 7.08,67.4 7.42,67.4 | 7.42,67.4 7.65,67.4 7.86,67.61 U$10.B7 | 6.93,65.66 7.42,66.14 7.42,67.4 | 6.93,65.66 v5.87,64.59 | v4.47,56.69 5,57.23 U$11.6 | 6.93,65.66 8.66,63.93 v8.93,63.93 | v14.01,63.93 12.79,63.93 U$7.6
  Bottom 0.254: v4.47,56.69 4.47,63.2 v5.87,64.59 | v8.93,63.93 v14.01,63.93
D_P  (via drill 0.3, 0.35)
  Top 0.254: U$10.B6 6.36,68.99 6.58,69.2 6.88,69.2 | 6.88,69.2 7.15,69.2 7.36,68.99 U$10.A6 | 6.88,69.2 v6.88,69.63 | v6.12,57.49 6.12,59.01 U$11.5 | U$7.3 v8.89,62.65
  Bottom 0.254: v6.12,57.49 6.88,58.26 6.88,63.69 | v6.88,69.63 6.88,63.69 | v8.89,62.65 7.92,62.65 6.88,63.69
DTR  (via drill 0.3)
  Top 0.349: v6.55,51.31 7.29,52.04 7.29,53.66 7.34,53.71 7.54,53.92 U$11.13 | v24.38,24.26 25.63,23.01 36.26,23.01 R24.1 38.25,20.58 38.48,20.34 38.48,20.32 40.29,18.52 Q1.2
  Bottom 0.349: v6.55,51.31 6.88,51.31 7.85,50.34 11.12,50.34 12.19,51.41 14.76,51.41 19.81,46.35 19.81,28.83 v24.38,24.26
DW3  (via drill 0.3)
  Top 0.349: v48.54,14.66 50.52,14.66 J4.1 | U5.GPIO3 25.15,15.95 v25.76,16.56
  Bottom 0.349: v25.76,16.56 29.97,16.56 34.62,11.91 45.8,11.91 v48.54,14.66
DW4  (via drill 0.3)
  Top 0.349: U5.GPIO4 24.18,14.94 v25.76,14.94 | v48.77,11.81 52.12,11.81 J5.1
  Bottom 0.349: v25.76,14.94 29.41,14.94 33.93,10.41 47.37,10.41 v48.77,11.81
DW5  (via drill 0.3)
  Top 0.349: U5.GPIO5 23.96,13.31 v25.76,13.31 | v49,7.01 51.77,7.01 J6.1
  Bottom 0.349: v49,7.01 48.84,6.86 45.49,6.86 43.79,8.56 34.04,8.56 29.29,13.31 v25.76,13.31
DW6  (via drill 0.3)
  Top 0.349: U5.GPIO6 24.77,11.75 v25.76,10.77 | v48.79,2.97 52.09,2.97 J7.1
  Bottom 0.349: v25.76,10.77 29.52,10.77 32.92,7.37 43.28,7.37 47.68,2.97 v48.79,2.97
FSYNC/IO36
  Top 0.254: R20.1 12.98,44.94 12.51,44.94 11.5,43.94 11.44,43.87 11.41,43.85 U$12.11
  Top 0.508: Q7.2 13.05,44.96 R20.1
GND  (via drill 0.3, 0.35)
  Top 0.254: 6.98,45.48 6.98,44.01 7.14,43.85 U$12.20 | U$7.2 11.61,63.3 11.64,63.26 | U$12.18 8.22,45.36 8.1,45.48 6.94,45.48 | U3.GND 38.89,39.94 v39.4,39.94
  Top 0.349: v5.89,47.88 5.89,46.53 6.94,45.48 6.98,45.48 | U5.VSS 21.86,9.5 v24.71,9.5 | R14.1 12.43,28.59 v11.68,27.84 11.63,27.79 11.63,26.11 12.6,25.14 U5.VSS.3 U5.VSS.2 | 11.89,59.31 11.89,63.02 11.64,63.26 | U3.38 46.22,28.72 v46.2,28.7 | v15.44,25.65 15.4,25.61 U5.VSS.4 | U$9.1 20,55.63 v18.04,55.63
  Top 0.508: U2.2 25.96,73.33 26.44,72.85 v26.44,71.4 26.44,69.91 C17.2 | U$8.3 31.61,72.7 30.07,74.24 v30.07,74.3 | R11.1 18.27,67.54 v18.77,67.54 | C11.2 39.4,60.25 v39.42,60.22 | U$10.A12 3.91,67.54 2.97,66.6 2.97,65.16 R27.1 3.18,63.84 v2.62,63.27 v2.62,61.49 | R12.1 13.53,69.28 v13.56,69.32 | U$11.1 11.49,59.31 11.89,59.31
  Top 0.762: 28.89,61.04 C19.2 28.78,59.65 v28.75,59.63 | U$4.2 29.02,61.16 28.89,61.04 | U$5.GND 28.89,61.04 | U3.15 28.22,45.88 | C6.2 11.81,37.86 v12.31,37.86 | v5.89,47.88 6.31,48.3 C8.2 | C9.2 15.52,43.46 v16.44,44.38
  Top 1.016: R6.1 17.7,74.13 | C13.2 16.33,74.15 17.68,74.15 17.7,74.13 | 17.7,74.13 v17.7,73.52 | C16.2 17.14,58.69 C7.2 13.62,59.31 | 13.62,59.31 14.4,60.09 v14.4,60.4 | U5.VSS.5 22.91,22.45 v22.91,22.96 | C10.2 45.07,5.82 43.64,7.25 U$1.P3 43.46,7.32 43.46,7.35 | 43.46,7.35 43.46,8.99 | 43.46,8.99 U$3.P4 42.08,8.74 | U$1.P4 36.26,7.32 36.26,8.22 | 43.46,8.99 43.8,8.66 v45.31,8.66 | U$8.3 30.93,71.36 v29.64,72.64 | 36.26,8.22 U$3.P3 36.26,9.25 36.78,8.74 | 36.78,8.74 42.08,8.74 | 36.78,8.74 36.26,8.22 | 42.08,8.74 43.21,8.74 43.46,8.99 | 42.08,8.74 43.46,7.35 | v31.19,56.19 29.43,56.19 C1.2 27.15,56.3 C5.2 | 28.22,45.88 v29.08,46.74 | C2.2 19.92,5.5 C15.2 24.11,5.5 C14.2 26.11,5.45 | 26.11,5.45 v26.13,5.47 | U3.1 46.22,50.98 C4.2 46.16,52.32 v46.94,53.1 | 13.62,59.31 11.89,59.31 | C3.2 28.18,5.45 26.11,5.45
  GND1 0.152: v36.4,41.91 37.3,41.91 37.32,41.89 37.64,41.89 v37.67,41.92 | v38.89,41.9 40.1,41.9 40.22,41.78 40.36,41.78 v40.47,41.89 | v40.06,40.93 38.44,40.93 v38.42,40.91 | v37.13,40.96 37.13,40.63 v36.39,39.89 | v37.86,39.92 39.38,39.92 v39.4,39.94 | v40.6,39.92 40.6,39.58 v39.95,38.93 | v38.66,38.81 38.64,38.79 v37.29,38.79 | v36.55,37.76 37.96,37.76 v38.01,37.71 | v39.45,37.68 40.53,37.68 v40.59,37.74
  GND1 0.508: v12.63,20.06 12.97,19.72 v14.94,19.72 | v17.6,19.66 17.71,19.55 v19.53,19.55 | v20.84,17.61 v20.83,17.62 v18.8,17.62 | v16.37,17.46 14.31,17.46 v14.28,17.49 | v12.73,15.06 15.72,15.06 v15.99,15.33 | v17.95,15.35 20.26,15.35 v20.35,15.44 | v19.1,13.46 17.51,13.46 v17.25,13.72 | v14.8,13.4 12.52,13.4 v12.29,13.17
  other vias: 12.4,18.35
  pour GND2 (isolate 0.203): 0.25,75.95 55.63,75.95 55.63,52.04 46.76,52.04 46.74,52.02 46.74,27.43 46.74,27.33 55.63,27.33 55.63,0.25 11,0.25 10.97,0.28 10.97,33.91 0.3,33.91 0.25,33.96
  pour GND1 (isolate 0.203): 0.25,75.95 55.63,75.95 55.63,52.04 46.74,52.04 46.74,27.36 46.76,27.33 55.63,27.33 55.63,0.25 10.97,0.25 10.97,33.91 0.25,33.91
GPIO12
  Top 0.349: Q2.3 15.87,39.97 R19.1 23.55,39.99 25.78,42.22 25.78,46.05 28.3,48.57 U3.14
GPIO12/SDO
  Top 0.203: 12.11,40.58 12.11,42.65 11.71,43.05 U$12.9
  Top 0.254: 12.11,40.58 13.12,39.57 R18.1
  Top 0.349: R18.1 14.62,39.57 Q2.2
GPIO13
  Top 0.254: R17.1 Q5.3
  Top 0.349: R17.1 10.25,37.5 11.46,36.3 24.77,36.3 26.82,38.35 26.82,43.33 27.51,44.02 U3.16
GPIO13/SDI
  Top 0.203: U$12.24 7.1,41.73 7.06,41.73
  Top 0.254: 7.06,41.73 7.06,39.92 7.16,39.82 R16.1
  Top 0.349: R16.1 Q5.2
GPIO14  (via drill 0.3)
  Top 0.349: v26.59,36.55 25.25,35.2 4.09,35.2 3.05,36.25 R5.1 2.95,39.01 2.95,39.55 3.17,39.77 Q6.3 | v31.01,46.79 31.01,48.54 U3.13
  Bottom 0.349: v26.59,36.55 31.01,40.97 v31.01,46.79
GPIO14/SCLK
  Top 0.203: U$12.23 6.79,42.65
  Top 0.254: 6.79,42.65 R4.1
  Top 0.349: R4.1 Q6.2
GPIO15
  Top 0.254: Q10.3 3.14,46.24 R2.1
  Top 0.349: Q10.3 1.66,43.01 1.55,42.9 1.4,42.75 1.4,35.97 3.15,34.21 26.19,34.21 27.1,35.13 U3.23
GPIO15/CS
  Top 0.254: R29.1 6.45,45.02 6.47,45 6.47,43.6 7.02,43.05 U$12.22
  Top 0.349: R29.1 4.32,45.02 Q10.2
GPIO35  (via drill 0.3)
  Top 0.349: U5.GPIO7 15.4,8.42 v16.59,7.24 | v34.54,36.22 34.54,35.1 32.03,32.59 23.32,32.59 v22.12,31.39 | v38.68,45.59 38.6,45.67 U3.7 | v26.82,9.04 26.82,21.51 v26.77,21.57
  Bottom 0.349: v16.59,7.24 17.78,8.43 26.21,8.43 v26.82,9.04 | v34.54,36.22 34.59,36.22 34.7,36.32 34.7,42.85 36.43,44.58 38.29,44.58 38.68,44.98 v38.68,45.59 | v22.12,31.39 22.12,30.28 27.66,24.74 27.66,23.57 26.77,22.68 v26.77,21.57
INT/IO39
  Top 0.203: U$12.12 11.57,45
  Top 0.254: R22.1 11.57,45
  Top 0.349: R22.1 Q8.2
IO0  (via drill 0.3)
  Top 0.349: R9.2 35.84,15.94 v35.84,21.82 | v27.25,31.32 28.97,31.32 U3.25
  Top 1.016: U$3.P2 42.33,14.03 41.24,15.12 Q1.3 39.02,14.03 U$3.P1 36.26,14.55 35.74,15.07 R9.2
  Bottom 0.349: v35.84,21.82 31.98,25.68 31.98,26.31 27.25,31.04 v27.25,31.32
IO5  (via drill 0.3)
  Top 0.349: v34.75,27.69 34.75,26.66 33.69,25.6 21.59,25.6 21,25.02 U5.SPICSN | v34.69,32.2 34.79,32.1 U3.29
  Bottom 0.349: v34.75,27.69 34.65,27.79 34.65,32.15 v34.69,32.2
IO18  (via drill 0.3)
  Top 0.349: U5.SPICLK 16.8,25.26 20.42,28.88 30.96,28.88 v30.99,28.91 | v35.97,35.13 35.97,32.2 36.06,32.1 U3.30
  Bottom 0.349: v30.99,28.91 30.99,32.26 33.86,35.13 v35.97,35.13
IO19  (via drill 0.3)
  Top 0.349: U5.SPIMISO 18.2,25.06 20.83,27.69 v32.28,27.69 | v37.23,32.2 37.23,30.67 U3.31
  Bottom 0.349: v32.28,27.69 32.28,31.98 34.09,33.78 36.98,33.78 37.23,33.53 v37.23,32.2
IO21  (via drill 0.3)
  Top 0.349: U3.33 39.87,32.94 v40.64,33.71 | v41.3,26.57 44.73,26.57 46.86,24.43 48.64,24.43 J3.1
  Bottom 0.349: v40.64,33.71 39.9,32.97 39.9,27.96 v41.3,26.57
IO22  (via drill 0.3)
  Top 0.349: U3.36 43.68,31.57 v44.68,32.56 | v43.41,27.81 45.06,27.81 46.46,26.42 50.77,26.42 51.89,25.3 J2.1
  Bottom 0.349: v44.68,32.56 43.38,31.27 43.38,27.84 v43.41,27.81
IO23
  Top 0.349: U3.37 44.95,29.43 44.45,28.93 33.6,28.93 33.35,28.67 33.35,27.25 32.72,26.62 21.19,26.62 19.6,25.04 U5.SPIMOSI
IO25
  Top 0.349: U3.10 34.79,51.23 41.58,58.01 48.74,58.01 J8.1
IO26
  Top 0.349: U3.11 33.52,51.51 41.05,59.03 44.02,59.03 45.01,60.02 J9.1
IO27  (via drill 0.3)
  Top 0.349: R13.2 16.79,3.92 28.87,3.92 29.77,4.83 29.77,19.58 v29.82,19.63 | v32.16,45.49 32.16,48.48 U3.12
  Bottom 0.349: v32.16,45.49 32.13,45.47 32.13,40.44 27.08,35.38 24.36,35.38 23.8,34.82 23.8,32.16 23.82,32.13 23.82,30.12 28.96,24.99 28.96,20.5 v29.82,19.63
IO32  (via drill 0.3)
  Top 0.349: R25.2 14.48,2.96 29.25,2.96 31.14,4.85 31.14,18.47 v31.19,18.52 | v37.37,46.58 37.37,48.54 U3.8
  Bottom 0.349: v31.19,18.52 31.19,20.37 29.92,21.64 29.92,25.5 24.77,30.66 24.77,33.88 25.25,34.37 27.84,34.37 33.05,39.57 33.02,39.6 33.02,44.83 35.28,47.09 37.21,47.09 37.37,46.93 v37.37,46.58
IO33  (via drill 0.3)
  Top 0.349: R1.2 12.17,1.77 29.55,1.77 32.31,4.52 32.31,19.7 v32.27,19.74 | v35.99,45.64 35.99,48.5 U3.9
  Bottom 0.349: v32.27,19.74 32.27,20.9 30.96,22.21 30.96,25.93 25.81,31.09 25.81,33.17 26.19,33.55 28.45,33.55 33.82,38.92 33.82,43.47 v35.99,45.64
IO34  (via drill 0.3)
  Top 0.349: U5.IRQ/GPIO8 13.92,23.04 R14.2 14.31,27.28 16.18,27.28 v22.05,33.15 | v22.2,45.01 26.31,49.12 26.31,50.7 v26.92,51.31 | U3.6 39.93,48.63 39.93,50.44 v38.99,51.38
  Bottom 0.349: v22.2,45.01 22.05,44.86 v22.05,33.15 | v38.99,51.38 27,51.38 v26.92,51.31
IO36  (via drill 0.3)
  Top 0.349: v28.37,49.91 28.37,49.78 24.06,45.48 24.06,44.26 23.57,43.76 21.57,43.76 19.85,45.48 R21.1 15.43,45.48 Q7.3 | U3.4 v42.42,46.91
  Bottom 0.349: v28.37,49.91 39.42,49.91 v42.42,46.91
IO39  (via drill 0.3)
  Top 0.349: v28.68,52.7 28.55,52.83 15.39,52.83 14.3,51.74 14.3,49.76 13.33,48.78 11.22,48.78 Q8.3 11.07,50.35 R23.1 | U3.5 41.14,51.25 v41.17,51.28
  Bottom 0.349: v41.17,51.28 39.75,52.7 v28.68,52.7
N$1
  Top 0.349: R24.2 40.63,21.26 47.55,21.26 47.57,21.24 Q4.1
N$2  (via drill 0.3)
  Top 0.349: R3.2 45.06,24.05 v45.31,23.81 | v43.13,19.99 43.13,19.22 Q1.1
  Bottom 0.349: v45.31,23.81 45.17,23.81 43.13,21.77 v43.13,19.99
N$3
  Top 1.016: U2.5 19.58,72.38 R6.2
N$4
  Top 0.349: R8.1 21.69,55.82 U$9.2
N$7
  Top 0.762: U2.1 25.15,71.37 23.44,69.66 U$6.1
N$8
  Top 1.016: U$2.1 34.9,63.09 U$4.5 U$4.4
N$9
  Top 0.508: U$5.EN R15.2
N$10
  Top 0.349: U5.EXTON 11.2,8.41 11.18,8.38 11.18,4.36 R1.1
N$11
  Top 0.349: U5.WAKEUP 12.55,10.3 12.55,4.95 12.89,4.61 R25.1
N$12
  Top 0.349: U5.RST 13.95,10.3 13.95,6.06 14.29,5.73 R13.1
N$13
  Top 0.203: U$12.10 13.12,43.45
  Top 0.254: C9.1 13.14,43.47 13.12,43.45
N$14
  Top 0.508: 21.77,61.22 C12.1
  Top 0.762: U$5.C- 22.95,61.99 22.94,62 22.54,62 21.77,61.22
N$15
  Top 0.508: U$5.C+ 24.93,59.7 24.94,59.69
  Top 0.762: C12.2 21.83,59.26 24.51,59.26 24.94,59.69
N$16
  Top 0.254: R27.2 5.36,65.84 U$10.B5
N$17  (via drill 0.3)
  Top 0.254: U$10.A5 8.36,65.97 v8.5,65.83 | v11.18,66.42 11.81,67.06 R12.2
  Bottom 0.254: v8.5,65.83 10.58,65.83 v11.18,66.42
RESET  (via drill 0.3)
  Top 0.349: v44.7,44.45 43.68,45.47 U3.3 | Q4.3 48.02,15.84 48.54,16.36 v48.54,22.15
  Top 1.016: R10.2 33.95,3.37 36.17,3.37 U$1.P2 U$1.P1 44.1,3.35 44.87,4.12 C10.1 46.89,4.12 47.6,4.83 47.6,10.16 45.67,12.09 45.49,12.09 45.49,15.82 45.51,15.84 Q4.3
  Bottom 0.349: v44.7,44.45 44.81,44.35 45.31,44.35 45.95,43.71 45.95,30.66 45.92,30.66 44.93,29.67 44.93,25.76 v48.54,22.15
RTS  (via drill 0.3)
  Top 0.349: v26.36,24.33 26.42,24.28 40.81,24.28 R3.1 41.03,22.25 46.02,22.25 v46.15,22.38 | v44.76,19.86 44.76,18.79 Q4.2 | U$11.14 8.81,52.24 v8.8,52.23
  Bottom 0.349: v8.8,52.23 15.41,52.23 20.9,46.74 20.9,29.79 v26.36,24.33 | v46.15,22.38 46.15,21.26 v44.76,19.86
RX-TX_N  (via drill 0.3)
  Top 0.349: v29.95,44.63 30.23,44.35 32.97,44.35 33.55,44.93 34.72,44.93 35.31,44.35 39.27,44.35 39.75,44.83 40.59,44.83 40.97,44.45 42.2,44.45 43.2,43.44 43.2,32.77 42.41,31.97 U3.35 | v10.32,60.81 10.12,60.61 10.12,58.9 10.09,58.93 U$11.2
  Bottom 0.349: v29.95,44.63 25.75,44.63 12.52,57.86 12.52,58.56 10.29,60.79 v10.32,60.81
RX-TX_P  (via drill 0.3)
  Top 0.349: v29.95,43 30.1,43.44 41.39,43.44 42.36,42.48 42.36,32.92 41.14,31.7 U3.34 | v29.95,43 | v29.95,43 | v8.71,60.81 8.85,60.68 8.85,59.2 U$11.3
  Bottom 0.349: v29.95,43 25.96,43 11.23,57.73 10.03,57.73 8.71,59.05 v8.71,60.81
V_BATT
  Top 0.762: 27.53,74.37 25.24,74.37 U2.3
  Top 1.016: U$8.4 28.27,69.36 C17.1 | C17.1 27.93,73.98 27.53,74.37 | Q3.3 22.66,65.69 24.43,67.46 27.94,67.46 27.94,69.68 C17.1
V_IN  (via drill 0.3)
  Top 0.508: U$4.3 31.7,60.2 31.7,59.69
  Top 0.762: U$4.1 31.14,62.69 | U$5.VIN 24.89,60.99 24.16,60.99 23.85,60.68 v23.32,60.68 | 26.13,65 26.13,64.09 R15.1 25.46,63.4 | D1.1 17.85,61.34 19.18,61.34
  Top 1.016: C16.1 19.18,59.02 19.18,61.34 20.57,62.73 Q3.2 21.01,63.4 v24.76,63.4 25.46,63.4 | 31.14,62.69 31.14,62.79 v30.53,62.79 28.94,62.79 C19.1 28.78,65.28 28.47,65.58 26.72,65.58 26.13,65 | 31.7,59.69 31.67,59.66 30.61,59.66 v30.38,59.89
  Bottom 0.762: v24.76,63.4 23.32,61.95 v23.32,60.68
  Bottom 1.016: v30.38,59.89 30.53,60.05 v30.53,62.79
V_USB  (via drill 0.3)
  Top 0.349: 10.92,64.21 U$7.1
  Top 0.508: 14.07,65.46 13.39,64.77 11.18,64.77 | 11.18,64.77 9.51,66.43 U$10.A4 | 11.18,64.77 10.92,64.52 10.92,64.21
  Top 0.762: 16.31,65.58 17.32,65.58 R11.2 | 18.36,65.53 17.43,65.53 R11.2 | R11.2 D1.2
  Top 1.016: 14.07,65.46 14.22,65.61 15.32,65.61 | 15.32,65.61 15.32,68.92 R7.2 16.04,72.14 C13.1 17.23,72.15 17.25,72.12 17.28,72.12 v17.75,71.65 | v21.26,73.78 22.05,73.78 U2.4 | 15.32,65.61 15.34,65.58 16.31,65.58 | Q3.1 20.35,65.53 18.36,65.53
  Bottom 1.016: v17.75,71.65 19.14,71.65 v21.26,73.78

### Text on the board
tNames: USB - C | BATT | U$6 | U$2 | U$4 | TEAM VESTIGO / POSITION TAG | G$1 | U$7 | U$5 | U$9 | IO0 BTN | RESET BTN